# Altium schematic sheet Rev 1.0.SchDoc
size 431 x 279 mm; SheetNumber: 1; SheetTotal: 1
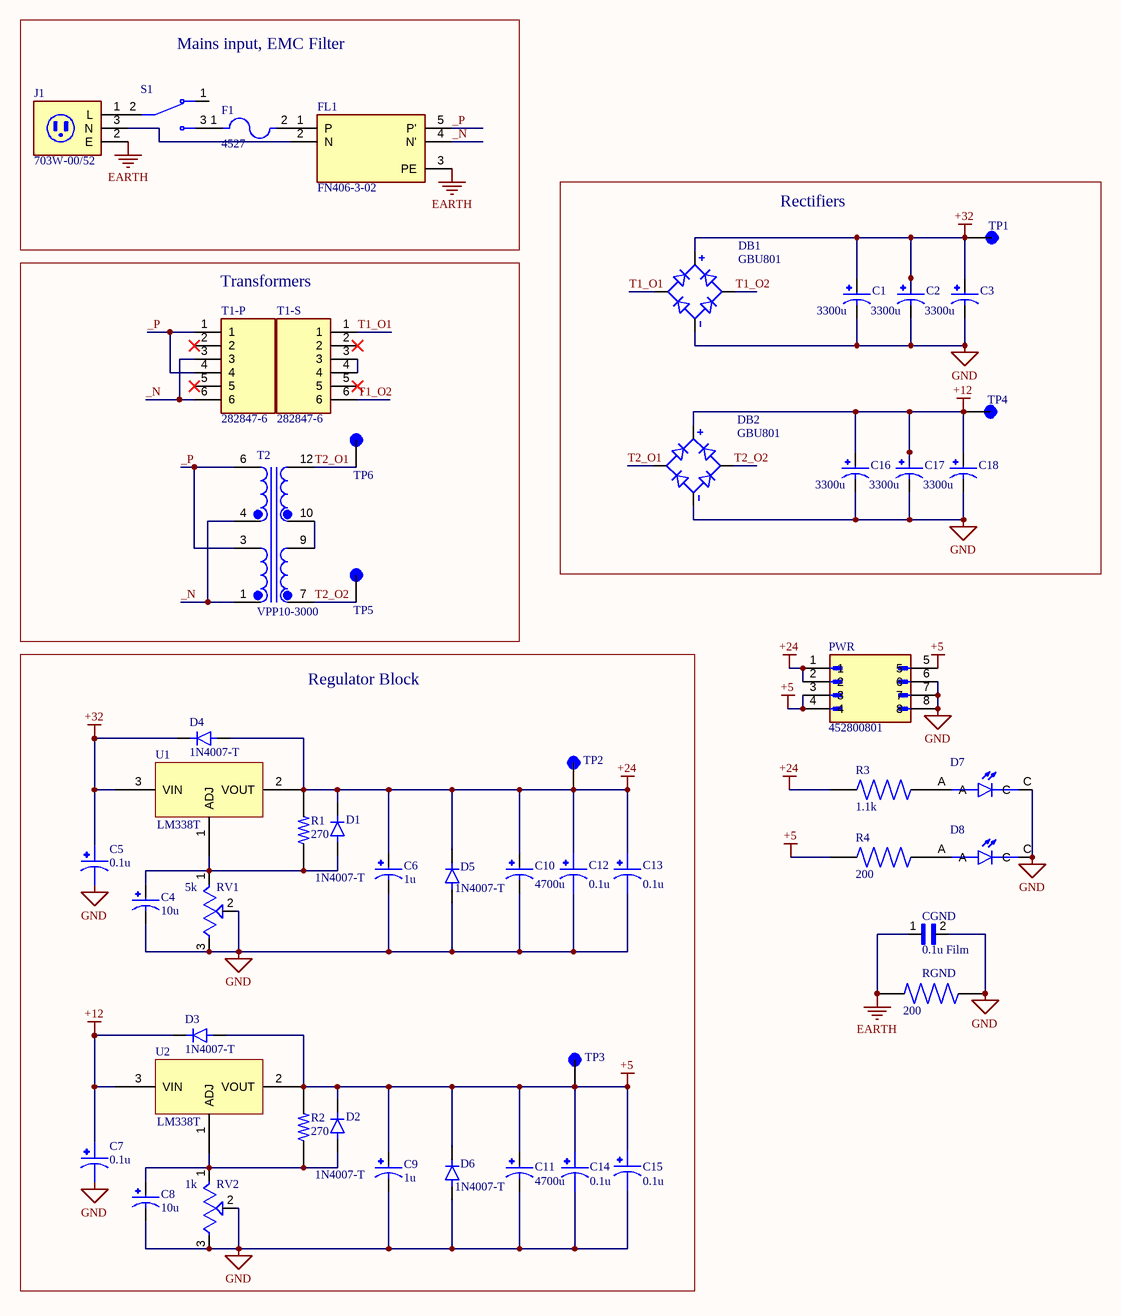
[diagram p0: Rev 1.0.SchDoc]

## Parts
C1  UVZ1H332MHD  [CAPPRD750W80D1800H3550]  (value not drawn)
C2  UVZ1H332MHD  [CAPPRD750W80D1800H3550]  (value not drawn)
C3  UVZ1H332MHD  [CAPPRD750W80D1800H3550]  (value not drawn)
C4  10u  [6.35mm Tantalum Radial]
C5  0.1u  [CAPPRD200W50D550H1250]
C6  1u  [6.35mm Tantalum Radial]
C7  0.1u  [CAPPRD200W50D550H1250]
C8  10u  [6.35mm Tantalum Radial]
C9  1u  [6.35mm Tantalum Radial]
C10  4700u  [CAPPRD750W80D1800H3550]
C11  4700u  [CAPPRD750W80D1800H3550]
C12  0.1u  [CAPPRD200W50D550H1250]
C13  0.1u  [CAPPRD200W50D550H1250]
C14  0.1u  [CAPPRD200W50D550H1250]
C15  0.1u  [CAPPRD200W50D550H1250]
C16  UVZ1H332MHD  [CAPPRD750W80D1800H3550]  (value not drawn)
C17  UVZ1H332MHD  [CAPPRD750W80D1800H3550]  (value not drawn)
C18  UVZ1H332MHD  [CAPPRD750W80D1800H3550]  (value not drawn)
CGND  0.1u Film  [CAPRR500W50L730T450H950]
D1  1N4007-T  [DIOAD780W78L463D236]
D2  1N4007-T  [DIOAD780W78L463D236]
D3  1N4007-T  [DIOAD780W78L463D236]
D4  1N4007-T  [DIOAD780W78L463D236]
D5  1N4007-T  [DIOAD780W78L463D236]
D6  1N4007-T  [DIOAD780W78L463D236]
D7  WP7113ID  [LED_WP7113ID]  (value not drawn)
D8  WP7113ID  [LED_WP7113ID]  (value not drawn)
DB1  GBU801  [SIP343W114P508L2205H2134Q4]
DB2  GBU801  [SIP343W114P508L2205H2134Q4]
F1  4527  [FUSE_4527]
FL1  FN406-3-02  [FIL_FN406-3-02]
J1  703W-00/52  [QUALTEK_703W-00/52]
PWR  452800801  [MOLEX_452800801]
R1  270  [RESAD730W45L360D200]
R2  270  [RESAD730W45L360D200]
R3  1.1k  [RESAD1520W70L1030D380]
R4  200  [RESAD1520W70L1030D380]
RGND  200  [RESAD1520W70L1030D380]
RV1  5k  [TRIM_3306F-1-502]
RV2  1k  [TRIM_3306F-1-502]
S1  300SP1J1BLKM7QE  [SW_300SP1J1BLKM7QE]  (value not drawn)
T1-P  282847-6  [TE_282847-6]
T1-S  282847-6  [TE_282847-6]
T2  VPP10-3000  [XFMR_VPP10-3000]
TP1  5000  [KEYSTONE_5000]  (value not drawn)
TP2  5000  [KEYSTONE_5000]  (value not drawn)
TP3  5000  [KEYSTONE_5000]  (value not drawn)
TP4  5000  [KEYSTONE_5000]  (value not drawn)
TP5  5000  [KEYSTONE_5000]  (value not drawn)
TP6  5000  [KEYSTONE_5000]  (value not drawn)
U1  LM338T  [TO254P1054X470X1955-3]
U2  LM338T  [TO254P1054X470X1955-3]

## Blocks framed on the sheet
Mains input, EMC Filter: F1 FL1 J1 S1
Rectifiers: C1-C3 C16-C18 DB1 DB2 TP1 TP4
Transformers: T1-P T1-S T2 TP5 TP6
Regulator Block: C4-C15 D1-D6 R1 R2 RV1 RV2 TP2 TP3 U1 U2

## Nets
+5: C9.P C11.P C14.1 C15.1 D2.K D3.A D6.K PWR.3 PWR.4 PWR.5 R2.2 R4.1 TP3.TP U2.2(VOUT)
+12: C7.1 C16.P C17.P C18.P D3.K DB2.POS TP4.TP U2.3(VIN)
+24: C6.P C10.P C12.1 C13.1 D1.K D4.A D5.K PWR.1 PWR.2 R1.2 R3.1 TP2.TP U1.2(VOUT)
+32: C1.P C2.P C3.P C5.1 D4.K DB1.POS TP1.TP U1.3(VIN)
EARTH: CGND.1 FL1.3(PE) J1.2(E) RGND.1
GND: C1.N C2.N C3.N C4.N C5.2 C6.N C7.2 C8.N C9.N C10.N C11.N C12.2 C13.2 C14.2 C15.2 C16.N C17.N C18.N CGND.2 D5.A D6.A D7.C D8.C DB1.NEG DB2.NEG PWR.6 PWR.7 PWR.8 RGND.2 RV1.2(W) RV1.3(CW) RV2.2(W) RV2.3(CW)
_N: FL1.4(N') T1-P.3 T1-P.6 T2.1 T2.4
_P: FL1.5(P') T1-P.1 T1-P.4 T2.3 T2.6
T1_O1: DB1.AC2 T1-S.1
T1_O2: DB1.AC1 T1-S.6
T2_O1: DB2.AC2 T2.12 TP6.TP
T2_O2: DB2.AC1 T2.7 TP5.TP
NetC4_P: C4.P D1.A R1.1 RV1.1(CCW) U1.1(ADJ)
NetC8_P: C8.P D2.A R2.1 RV2.1(CCW) U2.1(ADJ)
NetD7_A: D7.A R3.2
NetD8_A: D8.A R4.2
NetF1_1: F1.1 S1.3
NetF1_2: F1.2 FL1.1(P)
NetFL1_2: FL1.2(N) J1.3(N)
NetJ1_1: J1.1(L) S1.2
NetT1-S_3: T1-S.3 T1-S.4
NetT2_9: T2.9 T2.10

Not connected (* = marked no-connect by the designer): S1 1; T1-P 2* 5*; T1-S 2* 5*

## Notes on the sheet
- (near C1) 3300u
- 3300u
- (near C16) 3300u
- DWG. NO.
- REV.
- SHT.
- THIS DOCUMENT AND THE DATA DISCLOSED HEREIN OR HEREWITH IS THE PROPERTY OF ALTIUM LIMITED AND MAY BE FREELY DISTRIBUTED IN WHOLE. NO RIGHTS ARE RESERVED OR EXPRESS OR IMPLIED WARANTEE GIVEN.
- REVISION
- DESCRIPTION
- DATE
- APPROVED
- ENG:
- APPROVALS
- PROJECT
- DSN:
- CHK:
- REFERENCE DOCUMENTS
- PROJECT REVISION:
- TITLE
- DOCUMENT REVISION:
- DESIGN ITEM:
- BOM:
- FAB DWG:
- PCB DWG:
- ASSY DWG:
- SCALE:
- SIZE
- B
- CAGE CODE
- FILE NAME
- DWG NO.
- SHEET
- OF
- REV

## Library data of the parts
C1-C4 C6 C8-C11 C16-C18 = ECA1VHG472: NHG-A; MF: {'manufacturer': u'Panasonic'}; Value: *; Price: None; Package: None; MP: ECA1VHG472; Availability: Unavailable
C5 C7 C12-C15 = UVR1H0R1MDD: 0.47ÂµF 100V Aluminum Electrolytic Capacitors Radial, Can 2000 Hrs @ 85Â°C; MF: {'manufacturer': u'Nichicon'}; MP: UVR1H0R1MDD; Availability: Unavailable; Package: None; Price: None; Value: *
CGND = B32529C3104K289: MF: {'manufacturer': u'EPCOS'}; MP: B32529C3104K289; Availability: Unavailable; Package: None; Price: None; Value: *
D1-D6 = 1N4007-T: MF: {'manufacturer': u'Diodes Incorporated'}; Value: *; Price: None; Package: None; MP: 1N4007-T; Availability: Unavailable
D7 D8 = WP7113ID: LED; Thru-Hole; Green; T1-3/4; 5mm; Clear Lens; 25ma; 565nm; 200mcd; Round; MF: {'manufacturer': u'Kingbright'}; Value: *; Price: None; Package: None; MP: WP7113ID; Availability: Unavailable
DB1 DB2 = GBU801: MF: {'manufacturer': u'Diodes Inc.'}; Price: None; Package: None; Availability: Unavailable; Value: *; MP: GBU801
F1 = 4527: MF: {'manufacturer': u'Keystone'}; Value: *; Price: None; Package: None; MP: 4527; Availability: Unavailable
FL1 = FN406-3-02: Single Phase EMC/EMI Line Filter 3A 250VAC DC ~ 400Hz Single Stage PC Pins; MF: {'manufacturer': u'Schaffner EMC'}; MP: FN406-3-02; Availability: Unavailable; Package: None; Price: None; Value: *
J1 = 703W-00/52: 3 Position 250 V 10 A Male Pins AC Receptacle Right Angle Connector; MF: {'manufacturer': u'Qualtek'}; Value: *; Price: None; Package: None; MP: 703W-00/52; Availability: Unavailable
PWR = 452800801: MF: {'manufacturer': u'Molex'}; Availability: Unavailable; Value: *; Price: None; Package: None; MP: 452800801
R1 R2 = CF18JT680R: Res Carbon Film 680 Ohm 5% 0.125W(1/8W) -400ppm/C to 0ppm/C Conformal Coated AXL T/R; MF: {'manufacturer': u'Stackpole Electronics'}; MP: CF18JT680R; Availability: Unavailable; Package: None; Price: None; Value: *
R3 R4 RGND = CBT50J5R1: 5.1 Ohms +/-5% 0.5W, 1/2W Through Hole Resistor Axial Pulse Withstanding Carbon Composition; MF: {'manufacturer': u'TE Connectivity / AMP'}; Price: None; Package: None; Availability: Unavailable; Value: *; MP: CBT50J5R1
RV1 RV2 = 3306F-1-502: 2 kOhms 0.2W, 1/5W PC Pins Through Hole Trimmer Potentiometer Cermet 1 Turn Top Adjustment; MF: {'manufacturer': u'Bourns'}; MP: 3306F-1-502; Availability: Unavailable; Package: None; Price: None; Value: *
S1 = 300SP1J1BLKM7QE: MF: {'manufacturer': u'E-Switch'}; MP: 300SP1J1BLKM7QE; Availability: Unavailable; Package: None; Price: None; Value: *
T1-P T1-S = 282847-6: MF: {'manufacturer': u'TE Connectivity'}; Price: None; Package: None; Availability: Unavailable; Value: *; MP: 282847-6
T2 = VPP10-3000: Power Transformer 4000Vrms Dual Prim. Dual Sec. 230V/115V Prim. 10V/5V Sec. Through Hole; MF: {'manufacturer': u'Triad Magnetics'}; Price: None; Package: None; Availability: Unavailable; Value: *; MP: VPP10-3000
TP1-TP6 = 5000: MF: {'manufacturer': u'Keystone Electronics'}; MP: 5000; Availability: Unavailable; Package: None; Price: None; Value: *
U1 U2 = LM338T/NOPB-ND